# EAGLE design macu_board (EAGLE 6.5.0)
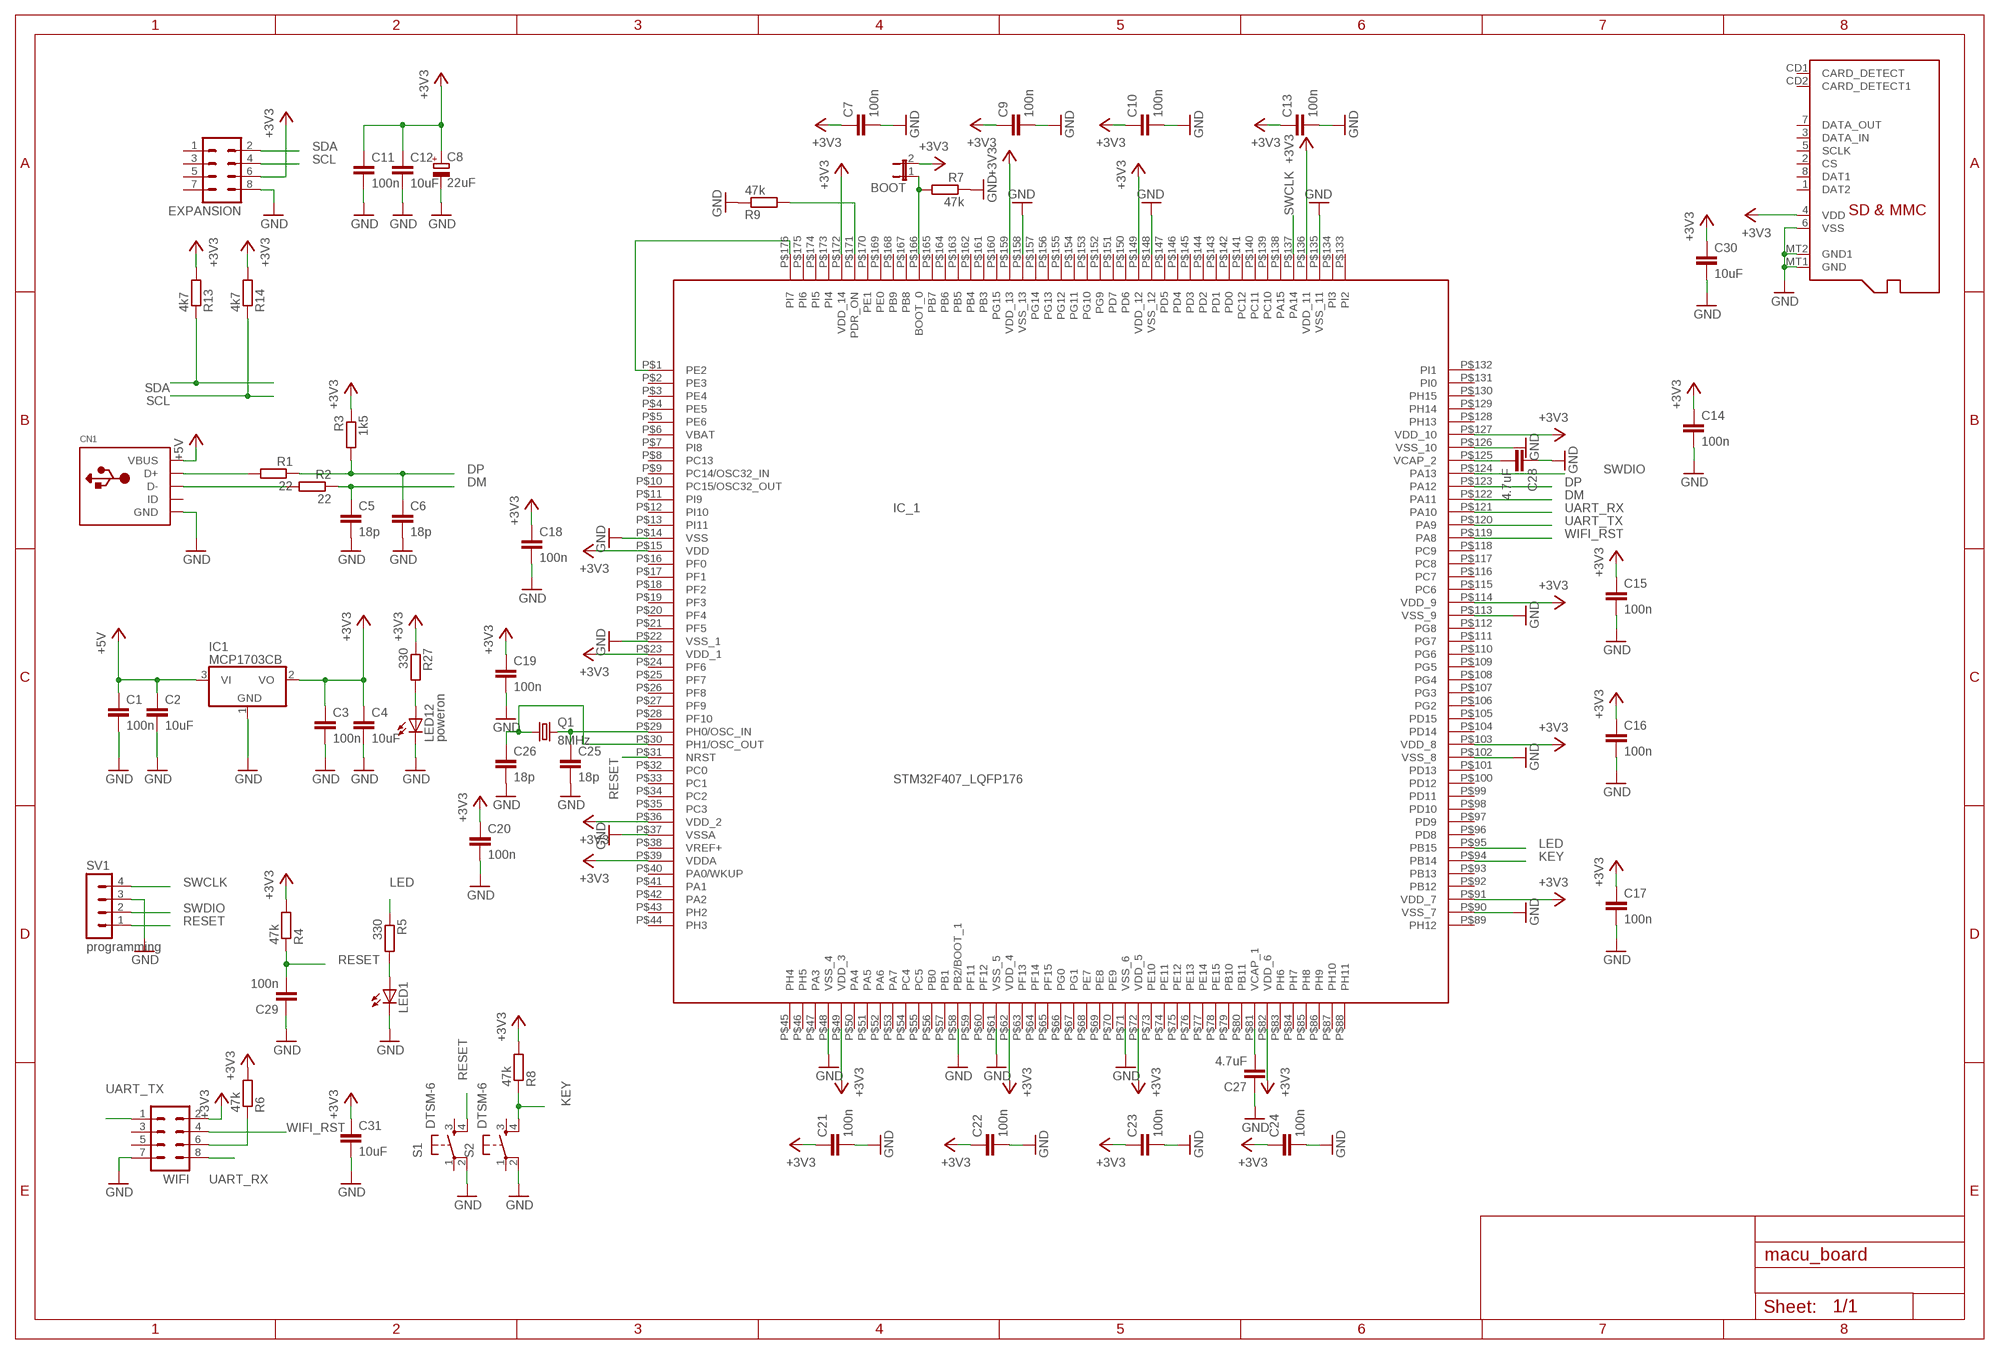
[diagram p0: schematic, sheet 1]

## Parts
BOOT  JP1E  [JP1]
C1  100n  C-EUC0805  [C0805]
C2  10uF  C-EUC0805  [C0805]
C3  100n  C-EUC0805  [C0805]
C4  10uF  C-EUC0805  [C0805]
C5  18p  C-EUC0805  [C0805]
C6  18p  C-EUC0805  [C0805]
C7  100n  C-EUC0805  [C0805]
C8  22uF  CPOL-EU153CLV-0505  [153CLV-0505]
C9  100n  C-EUC0805  [C0805]
C10  100n  C-EUC0805  [C0805]
C11  100n  C-EUC0805  [C0805]
C12  10uF  C-EUC0805  [C0805]
C13  100n  C-EUC0805  [C0805]
C14  100n  C-EUC0805  [C0805]
C15  100n  C-EUC0805  [C0805]
C16  100n  C-EUC0805  [C0805]
C17  100n  C-EUC0805  [C0805]
C18  100n  C-EUC0805  [C0805]
C19  100n  C-EUC0805  [C0805]
C20  100n  C-EUC0805  [C0805]
C21  100n  C-EUC0805  [C0805]
C22  100n  C-EUC0805  [C0805]
C23  100n  C-EUC0805  [C0805]
C24  100n  C-EUC0805  [C0805]
C25  18p  C-EUC0805  [C0805]
C26  18p  C-EUC0805  [C0805]
C27  4.7uF  C-EUC0805  [C0805]
C28  4.7uF  C-EUC0805  [C0805]
C29  100n  C-EUC0805  [C0805]
C30  10uF  C-EUC0805  [C0805]
C31  10uF  C-EUC0805  [C0805]
CN1  USBMINIB  [USB-MINIB]
EXPANSION  MA04-2  [MA04-2]
IC1  MCP1703CB  [SOT23]
IC_1  STM32F407_LQFP176  [STM32F407_LQFP176]
LED1  LEDCHIPLED_1206  [CHIPLED_1206]
LED12  poweron  LEDCHIPLED_1206  [CHIPLED_1206]
Q1  8MHz  CRYSTALCTS406  [CTS406]
R1  22  R-EU_M0805  [M0805]
R2  22  R-EU_M0805  [M0805]
R3  1k5  R-EU_M0805  [M0805]
R4  47k  R-EU_M0805  [M0805]
R5  330  R-EU_M0805  [M0805]
R6  47k  R-EU_M0805  [M0805]
R7  47k  R-EU_M0805  [M0805]
R8  47k  R-EU_M0805  [M0805]
R9  47k  R-EU_M0805  [M0805]
R13  4k7  R-EU_M0805  [M0805]
R14  4k7  R-EU_M0805  [M0805]
R27  330  R-EU_M0805  [M0805]
S1  DTSM-6  [DTSM-6]
S2  DTSM-6  [DTSM-6]
SV1  programming  MA04-1  [MA04-1]
U$1  MICROSD  [MICROSD]
WIFI  MA04-2  [MA04-2]

## Nets
+3V3: BOOT.2 C3.1 C4.1 C7.1 C8.+ C9.1 C10.1 C11.1 C12.1 C13.1 C14.1 C15.1 C16.1 C17.1 C18.1 C19.1 C20.1 C21.1 C22.1 C23.1 C24.1 C30.1 C31.1 EXPANSION.6 IC1.2(VO) IC_1.P$15(VDD) IC_1.P$23(VDD_1) IC_1.P$36(VDD_2) IC_1.P$39(VDDA) IC_1.P$49(VDD_3) IC_1.P$62(VDD_4) IC_1.P$72(VDD_5) IC_1.P$82(VDD_6) IC_1.P$91(VDD_7) IC_1.P$103(VDD_8) IC_1.P$114(VDD_9) IC_1.P$127(VDD_10) IC_1.P$136(VDD_11) IC_1.P$149(VDD_12) IC_1.P$159(VDD_13) IC_1.P$172(VDD_14) R3.1 R4.2 R6.2 R8.2 R13.2 R14.2 R27.1 U$1.4(VDD) WIFI.2
+5V: C1.1 C2.1 CN1.VBUS IC1.3(VI)
DM: C5.1 IC_1.P$122(PA11) R2.1
DP: C6.1 IC_1.P$123(PA12) R1.1 R3.2
GND: C1.2 C2.2 C3.2 C4.2 C5.2 C6.2 C7.2 C8.- C9.2 C10.2 C11.2 C12.2 C13.2 C14.2 C15.2 C16.2 C17.2 C18.2 C19.2 C20.2 C21.2 C22.2 C23.2 C24.2 C25.2 C26.2 C27.1 C28.1 C29.1 C30.2 C31.2 CN1.GND EXPANSION.8 IC1.1(GND) IC_1.P$14(VSS) IC_1.P$22(VSS_1) IC_1.P$37(VSSA) IC_1.P$48(VSS_4) IC_1.P$58(PB2/BOOT_1) IC_1.P$61(VSS_5) IC_1.P$71(VSS_6) IC_1.P$90(VSS_7) IC_1.P$102(VSS_8) IC_1.P$113(VSS_9) IC_1.P$126(VSS_10) IC_1.P$135(VSS_11) IC_1.P$148(VSS_12) IC_1.P$158(VSS_13) LED1.C LED12.C R7.1 R9.1 S1.2 S2.2 SV1.3 U$1.6(VSS) U$1.MT1(GND) U$1.MT2(GND1) WIFI.7
KEY: IC_1.P$94(PB14) R8.1 S2.4
LED: IC_1.P$95(PB15) R5.1
N$1: CN1.D+ R1.2
N$2: CN1.D- R2.2
N$3: C25.1 IC_1.P$29(PH0/OSC_IN) Q1.3
N$4: C26.1 IC_1.P$30(PH1/OSC_OUT) Q1.1
N$5: C27.2 IC_1.P$81(VCAP_1)
N$6: C28.2 IC_1.P$125(VCAP_2)
N$7: LED1.A R5.2
N$8: R6.1 WIFI.6
N$9: BOOT.1 IC_1.P$166(BOOT_0) R7.2
N$13: IC_1.P$171(PDR_ON) R9.2
N$14: IC_1.P$1(PE2) IC_1.P$176(PI7)
N$23: LED12.A R27.2
RESET: C29.2 IC_1.P$31(NRST) R4.1 S1.4 SV1.1
SCL: EXPANSION.4 R14.1
SDA: EXPANSION.2 R13.1
SWCLK: IC_1.P$137(PA14) SV1.4
SWDIO: IC_1.P$124(PA13) SV1.2
UART_RX: IC_1.P$121(PA10) WIFI.8
UART_TX: IC_1.P$120(PA9) WIFI.1
WIFI_RST: IC_1.P$119(PA8) WIFI.4
Unconnected: CN1.ID EXPANSION.1 EXPANSION.3 EXPANSION.5 EXPANSION.7 IC_1.P$2(PE3) IC_1.P$3(PE4) IC_1.P$4(PE5) IC_1.P$5(PE6) IC_1.P$7(PI8) IC_1.P$8(PC13) IC_1.P$9(PC14/OSC32_IN) IC_1.P$10(PC15/OSC32_OUT) IC_1.P$11(PI9) IC_1.P$12(PI10) IC_1.P$13(PI11) IC_1.P$16(PF0) IC_1.P$17(PF1) IC_1.P$18(PF2) IC_1.P$19(PF3) IC_1.P$20(PF4) IC_1.P$21(PF5) IC_1.P$24(PF6) IC_1.P$25(PF7) IC_1.P$26(PF8) IC_1.P$27(PF9) IC_1.P$28(PF10) IC_1.P$32(PC0) IC_1.P$33(PC1) IC_1.P$34(PC2) IC_1.P$35(PC3) IC_1.P$40(PA0/WKUP) IC_1.P$41(PA1) IC_1.P$42(PA2) IC_1.P$43(PH2) IC_1.P$44(PH3) IC_1.P$45(PH4) IC_1.P$46(PH5) IC_1.P$47(PA3) IC_1.P$50(PA4) IC_1.P$51(PA5) IC_1.P$52(PA6) IC_1.P$53(PA7) IC_1.P$54(PC4) IC_1.P$55(PC5) IC_1.P$56(PB0) IC_1.P$57(PB1) IC_1.P$59(PF11) IC_1.P$60(PF12) IC_1.P$63(PF13) IC_1.P$64(PF14) IC_1.P$65(PF15) IC_1.P$66(PG0) IC_1.P$67(PG1) IC_1.P$68(PE7) IC_1.P$69(PE8) IC_1.P$70(PE9) IC_1.P$73(PE10) IC_1.P$74(PE11) IC_1.P$75(PE12) IC_1.P$76(PE13) IC_1.P$77(PE14) IC_1.P$78(PE15) IC_1.P$79(PB10) IC_1.P$80(PB11) IC_1.P$83(PH6) IC_1.P$84(PH7) IC_1.P$85(PH8) IC_1.P$86(PH9) IC_1.P$87(PH10) IC_1.P$88(PH11) IC_1.P$89(PH12) IC_1.P$92(PB12) IC_1.P$93(PB13) IC_1.P$96(PD8) IC_1.P$97(PD9) IC_1.P$98(PD10) IC_1.P$99(PD11) IC_1.P$100(PD12) IC_1.P$101(PD13) IC_1.P$104(PD14) IC_1.P$105(PD15) IC_1.P$106(PG2) IC_1.P$107(PG3) IC_1.P$108(PG4) IC_1.P$109(PG5) IC_1.P$110(PG6) IC_1.P$111(PG7) IC_1.P$112(PG8) IC_1.P$115(PC6) IC_1.P$116(PC7) IC_1.P$117(PC8) IC_1.P$118(PC9) IC_1.P$128(PH13) IC_1.P$129(PH14) IC_1.P$130(PH15) IC_1.P$131(PI0) IC_1.P$132(PI1) IC_1.P$133(PI2) IC_1.P$134(PI3) IC_1.P$138(PA15) IC_1.P$139(PC10) IC_1.P$140(PC11) IC_1.P$141(PC12) IC_1.P$142(PD0) IC_1.P$143(PD1) IC_1.P$144(PD2) IC_1.P$145(PD3) IC_1.P$146(PD4) IC_1.P$147(PD5) IC_1.P$150(PD6) IC_1.P$151(PD7) IC_1.P$152(PG9) IC_1.P$153(PG10) IC_1.P$154(PG11) IC_1.P$155(PG12) IC_1.P$156(PG13) IC_1.P$157(PG14) IC_1.P$160(PG15) IC_1.P$161(PB3) IC_1.P$162(PB4) IC_1.P$163(PB5) IC_1.P$164(PB6) IC_1.P$165(PB7) IC_1.P$167(PB8) IC_1.P$168(PB9) IC_1.P$169(PE0) IC_1.P$170(PE1) IC_1.P$173(PI4) IC_1.P$174(PI5) IC_1.P$175(PI6) S1.1 S1.3 S2.1 S2.3 U$1.1(DAT2) U$1.2(CS) U$1.3(DATA_IN) U$1.5(SCLK) U$1.7(DATA_OUT) U$1.8(DAT1) U$1.CD1(CARD_DETECT) U$1.CD2(CARD_DETECT1) WIFI.3 WIFI.5

## Power pins joined to a net without a drawn wire
VBAT: IC_1.P$6(VBAT)
VREF+: IC_1.P$38(VREF+)

## Library data of the parts
BOOT = jumper:JP1E: JUMPER
C1-C7 C9-C31 = resistor:C-EU: CAPACITOR, European symbol
C8 = resistor:CPOL-EU: POLARIZED CAPACITOR, European symbol
CN1 = adafruit:USB: USB Connectors USBMINIB - Surface Mount Female Mini-B USB Connector 4UConnector: 06564 By microbuilder.eu Thru-hole RA Female Mini-B USB Connector 4UConnector: 18732 By ladyada.net
EXPANSION WIFI = con-lstb:MA04-2: PIN HEADER; OC_FARNELL: unknown; OC_NEWARK: unknown
IC1 = linear:MCP1703: 250 mA, 16V, Low Quiescent Current LDO Regulator Source: http://ww1.microchip.com/downloads/en/DeviceDoc/22049b.pdf
IC_1 = my_parts:STM32F407_LQFP176: STM32F407 in LQFP176 Package, 176 Pin Microcontroller (MCU) ARM Cortex M4 1024kB FLASH 168 Mhz 192kB SRAM
LED1 LED12 = led:LED: LED OSRAM: - CHIPLED LG R971, LG N971, LY N971, LG Q971, LY Q971, LO R971, LY R971 LH N974, LH R974 LS Q976, LO Q976, LY Q976 LO Q996 - Hyper CHIPLED LW Q18S LB Q993, LB Q99A, LB R99A - SideLED LS A670, LO A670, LY A670, LG A670, LP A670 LB A673, LV A673, LT A673, LW A673 LH A674 LY A675 LS A676, LA A676, LO A676, LY A676, LW A676 LS A679, LY A679, LG A679 - Hyper Micro SIDELED® LS Y876, LA Y876, LO Y876, LY Y876 LT Y87S - SmartLED LW L88C, LW L88S LB L89C, LB L89S, LG L890 LS L89K, LO L89K, LY L89K LS L896, LA L896, LO L896, LY L896 - TOPLED LS T670, LO T670, LY T670, LG T670, LP T670 LSG T670, LSP T670, LSY T670, LOP T670, LYG T670 LG T671, LOG T671, LSG T671 LB T673, LV T673, LT T673, LW T673 LH T674 LS T676, LA T676, LO T676, LY T676, LB T676, LH T676, LSB T676, LW T676 LB T67C, LV T67C, LT T67C, LS T67K, LO T67K, LY T67K, LW E67C LS E67B, LA E67B, LO E67B, LY E67B, LB E67C, LV E67C, LT E67C LW T67C LS T679, LY T679, LG T679 LS T770, LO T770, LY T770, LG T770, LP T770 LB T773, LV T773, LT T773, LW T773 LH T774 LS E675, LA E675, LY E675, LS T675 LS T776, LA T776, LO T776, LY T776, LB T776 LHGB T686 LT T68C, LB T68C - Hyper Mini TOPLED® LB M676 - Mini TOPLED Santana® LG M470 LS M47K, LO M47K, LY M47K Source: http://www.osram.convergy.de LUXEON: - LUMILED® LXK2-PW12-R00, LXK2-PW12-S00, LXK2-PW14-U00, LXK2-PW14-V00 LXK2-PM12-R00, LXK2-PM12-S00, LXK2-PM14-U00 LXK2-PE12-Q00, LXK2-PE12-R00, LXK2-PE12-S00, LXK2-PE14-T00, LXK2-PE14-U00 LXK2-PB12-K00, LXK2-PB12-L00, LXK2-PB12-M00, LXK2-PB14-N00, LXK2-PB14-P00, LXK2-PB14-Q00 LXK2-PR12-L00, LXK2-PR12-M00, LXK2-PR14-Q00, LXK2-PR14-R00 LXK2-PD12-Q00, LXK2-PD12-R00, LXK2-PD12-S00 LXK2-PH12-R00, LXK2-PH12-S00 LXK2-PL12-P00, LXK2-PL12-Q00, LXK2-PL12-R00 Source: www.luxeon.com KINGBRIGHT: KA-3528ASYC Source: www.kingbright.com
Q1 = crystal:CRYSTAL: CRYSTAL; OC_FARNELL: unknown; OC_NEWARK: unknown
R1-R9 R13 R14 R27 = resistor:R-EU_: RESISTOR, European symbol
S1 S2 = switch-tact:DTSM-6
SV1 = con-lstb:MA04-1: PIN HEADER; OC_FARNELL: unknown; OC_NEWARK: unknown
U$1 = adafruit:MICROSD: Micro-SD / Transflash card holder with SPI pinout For the 3M # 2908-05WB-MG and/or 4UCON #19656 push-push type

## Board
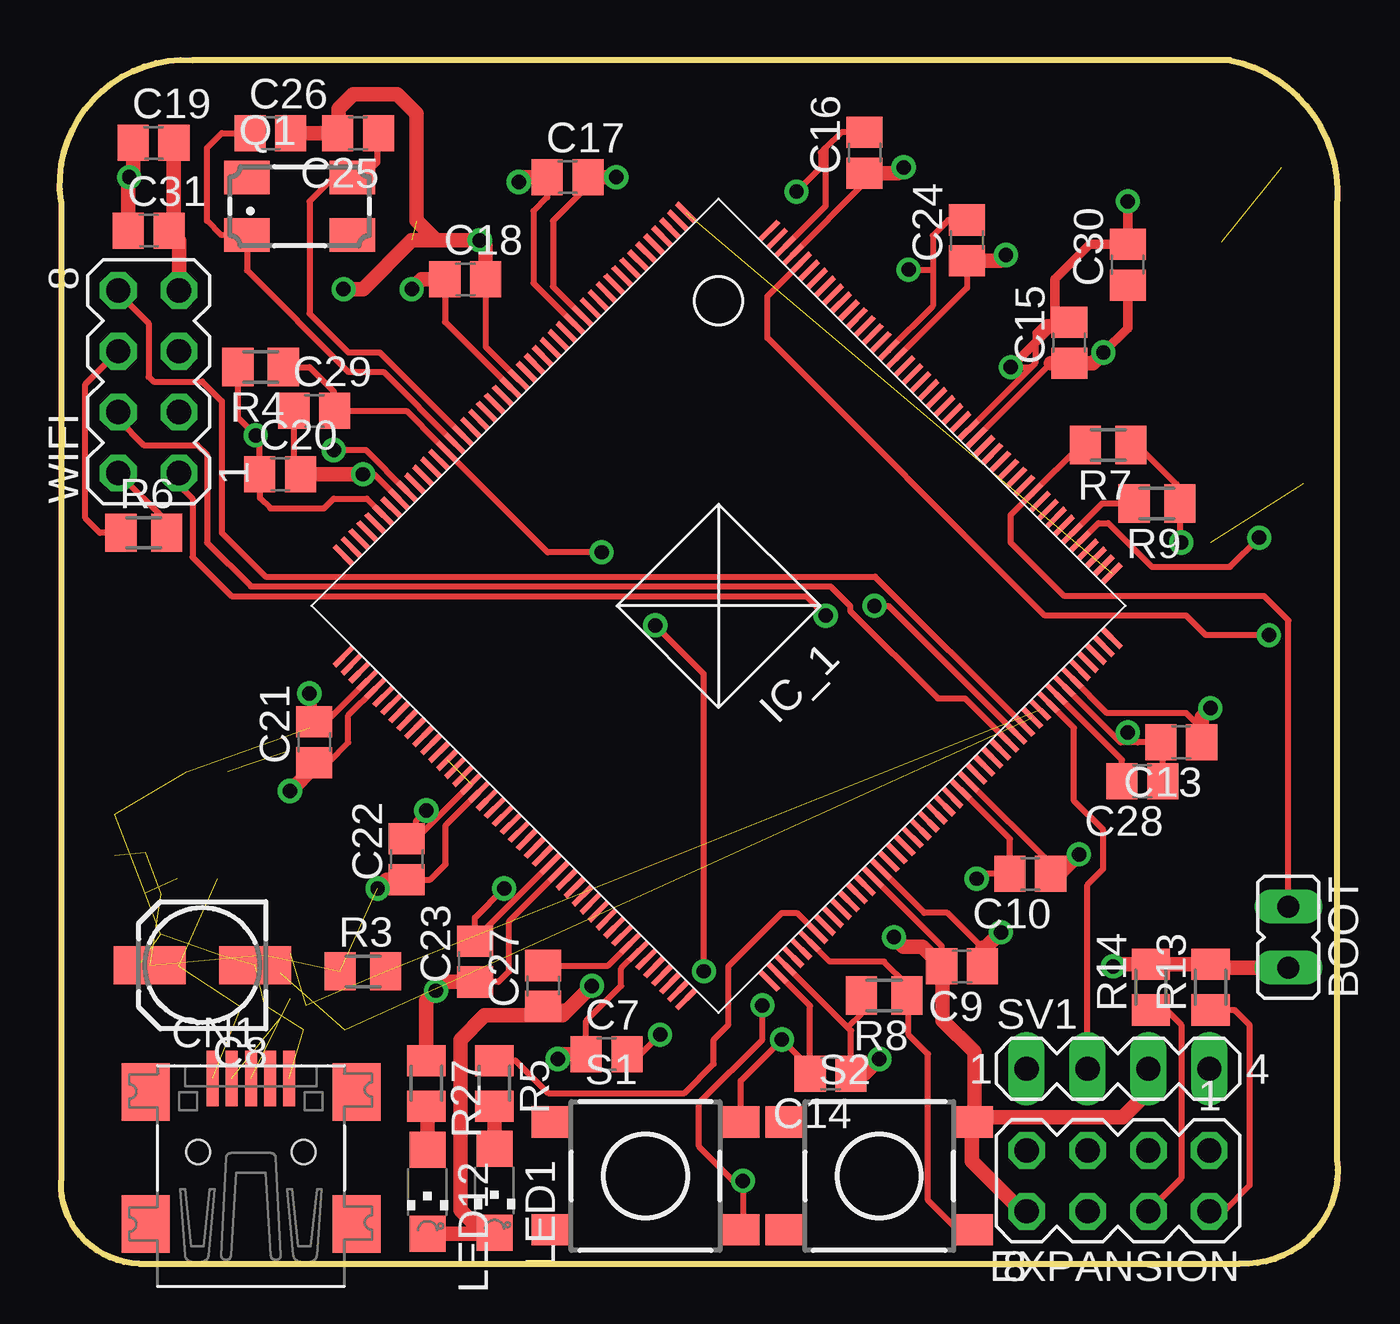
[diagram p1: board, top side]
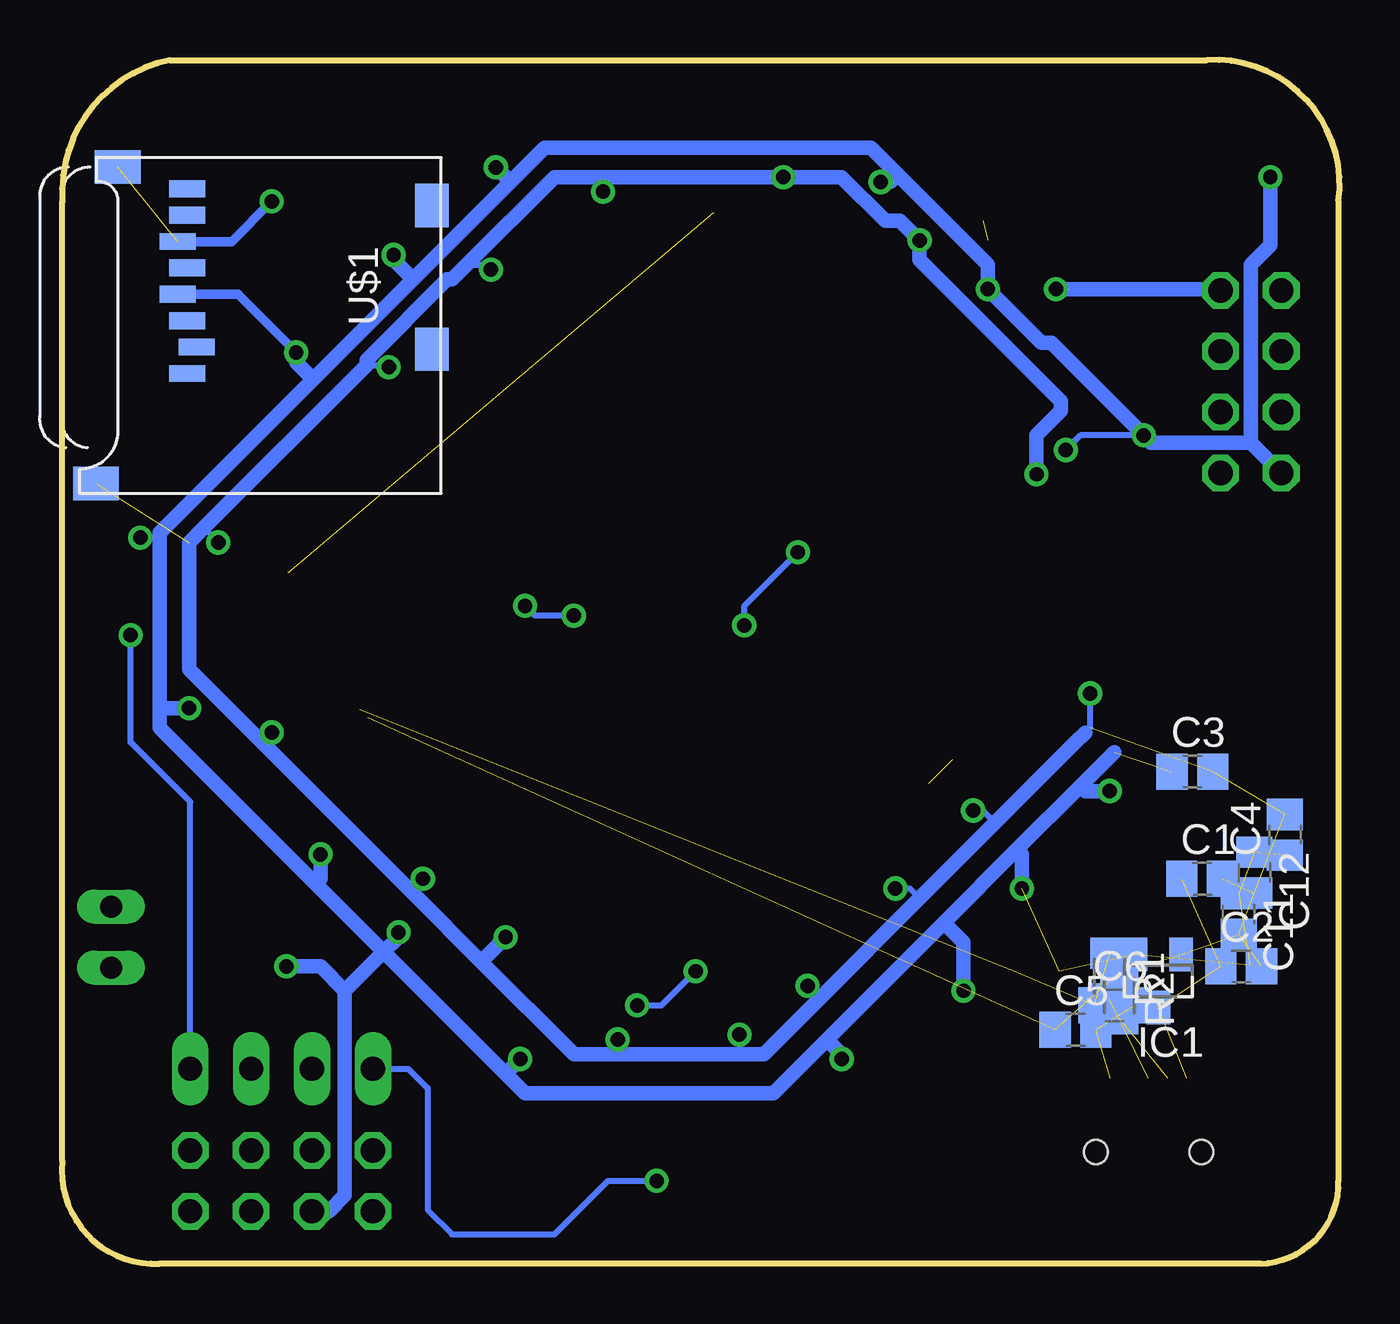
[diagram p2: board, bottom side, seen from below]

Size 53.3 x 50.2 mm. Coordinates in mm from the lower left corner, seen from the top.
Outline: 3.29,0 49.22,0 arc99 53.28,4.27 53.28,44.3 arc82 48.81,50.19 5.53,50.19 arc101 0.04,44.3 0.04,3.46 arc90 3.29,0
Copper layers (1*16): Top 0.035mm / dielectric 1.5mm / Bottom 0.035mm
Design rules "default *": minimum track width 7mil, minimum drill 24mil, track to track 7mil, track to pad 7mil, pad to pad 7mil, via to via 7mil, smd to smd 7mil, copper to edge 40mil, drill to drill 8mil, minimum pad ring 10mil, minimum via ring 8mil, stop-mask expansion 4mil, vias tented up to drill 0mil, thermal gap 10mil

### Footprints (pad centres in the part's own frame; a part is rotated, then mirrored left to right if it is on the bottom)
JP1 = drill 0.914 long: 1 0,-1.27; 2 0,1.27
C0805 = smd 1.3 x 1.5: 1 -0.85,0; 2 0.85,0
153CLV-0505 = smd 3 x 1.6: + 2.2,0; - -2.2,0
USB-MINIB = smd 0.5 x 2.308: D+ 0,4.064; D- -0.8,4.064; GND 1.6,4.064; ID 0.8,4.064; VBUS -1.6,4.064 | smd 2 x 2.4: GND1 -4.4,-2; GND2 -4.4,3.5; GND3 4.4,3.5; GND4 4.4,-2 | hole 1: -2.2,1; 2.2,1
MA04-2 = drill 1.016 octagon: 1 -3.81,-1.27; 2 -3.81,1.27; 3 -1.27,-1.27; 4 -1.27,1.27; 5 1.27,-1.27; 6 1.27,1.27; 7 3.81,-1.27; 8 3.81,1.27
SOT23 = smd 1 x 1.4: 1 -0.95,-1.1; 2 0.95,-1.1; 3 0,1.1
STM32F407_LQFP176 = smd 0.22 x 1.1: P$1 -10.64,-12.55; P$2 -10.17,-12.55; P$3 -9.7,-12.55; P$4 -9.23,-12.55; P$5 -8.76,-12.55; P$6 -8.29,-12.55; P$7 -7.82,-12.55; P$8 -7.35,-12.55; P$9 -6.88,-12.55; P$10 -6.41,-12.55; P$11 -5.94,-12.55; P$12 -5.47,-12.55; P$13 -5,-12.55; P$14 -4.53,-12.55; P$15 -4.06,-12.55; P$16 -3.59,-12.55; P$17 -3.12,-12.55; P$18 -2.65,-12.55; P$19 -2.18,-12.55; P$20 -1.71,-12.55; P$21 -1.24,-12.55; P$22 -0.77,-12.55; P$23 -0.3,-12.55; P$24 0.17,-12.55; P$25 0.64,-12.55; P$26 1.11,-12.55; P$27 1.58,-12.55; P$28 2.05,-12.55; P$29 2.52,-12.55; P$30 2.99,-12.55; P$31 3.46,-12.55; P$32 3.93,-12.55; P$33 4.4,-12.55; P$34 4.87,-12.55; P$35 5.34,-12.55; P$36 5.81,-12.55; P$37 6.28,-12.55; P$38 6.75,-12.55; P$39 7.22,-12.55; P$40 7.69,-12.55; P$41 8.16,-12.55; P$42 8.63,-12.55; P$43 9.1,-12.55; P$44 9.57,-12.55; P$89 9.56,12.55; P$90 9.09,12.55; P$91 8.62,12.55; P$92 8.15,12.55; P$93 7.68,12.55; P$94 7.21,12.55; P$95 6.74,12.55; P$96 6.27,12.55; P$97 5.8,12.55; P$98 5.33,12.55; P$99 4.86,12.55; P$100 4.39,12.55; P$101 3.92,12.55; P$102 3.45,12.55; P$103 2.98,12.55; P$104 2.51,12.55; P$105 2.04,12.55; P$106 1.57,12.55; P$107 1.1,12.55; P$108 0.63,12.55; P$109 0.16,12.55; P$110 -0.31,12.55; P$111 -0.78,12.55; P$112 -1.25,12.55; P$113 -1.72,12.55; P$114 -2.19,12.55; P$115 -2.66,12.55; P$116 -3.13,12.55; P$117 -3.6,12.55; P$118 -4.07,12.55; P$119 -4.54,12.55; P$120 -5.01,12.55; P$121 -5.48,12.55; P$122 -5.95,12.55; P$123 -6.42,12.55; P$124 -6.89,12.55; P$125 -7.36,12.55; P$126 -7.83,12.55; P$127 -8.3,12.55; P$128 -8.77,12.55; P$129 -9.24,12.55; P$130 -9.71,12.55; P$131 -10.18,12.55; P$132 -10.65,12.55 | smd 1.1 x 0.22: P$45 12.55,-9.57; P$46 12.55,-9.1; P$47 12.55,-8.63; P$48 12.55,-8.16; P$49 12.55,-7.69; P$50 12.55,-7.22; P$51 12.55,-6.75; P$52 12.55,-6.28; P$53 12.55,-5.81; P$54 12.55,-5.34; P$55 12.55,-4.87; P$56 12.55,-4.4; P$57 12.55,-3.93; P$58 12.55,-3.46; P$59 12.55,-2.99; P$60 12.55,-2.52; P$61 12.55,-2.05; P$62 12.55,-1.58; P$63 12.55,-1.11; P$64 12.55,-0.64; P$65 12.55,-0.17; P$66 12.55,0.3; P$67 12.55,0.77; P$68 12.55,1.24; P$69 12.55,1.71; P$70 12.55,2.18; P$71 12.55,2.65; P$72 12.55,3.12; P$73 12.55,3.59; P$74 12.55,4.06; P$75 12.55,4.53; P$76 12.55,5; P$77 12.55,5.47; P$78 12.55,5.94; P$79 12.55,6.41; P$80 12.55,6.88; P$81 12.55,7.35; P$82 12.55,7.82; P$83 12.55,8.29; P$84 12.55,8.76; P$85 12.55,9.23; P$86 12.55,9.7; P$87 12.55,10.17; P$88 12.55,10.64; P$133 -12.55,-9.57; P$134 -12.55,-9.1; P$135 -12.55,-8.63; P$136 -12.55,-8.16; P$137 -12.55,-7.69; P$138 -12.55,-7.22; P$139 -12.55,-6.75; P$140 -12.55,-6.28; P$141 -12.55,-5.81; P$142 -12.55,-5.34; P$143 -12.55,-4.87; P$144 -12.55,-4.4; P$145 -12.55,-3.93; P$146 -12.55,-3.46; P$147 -12.55,-2.99; P$148 -12.55,-2.52; P$149 -12.55,-2.05; P$150 -12.55,-1.58; P$151 -12.55,-1.11; P$152 -12.55,-0.64; P$153 -12.55,-0.17; P$154 -12.55,0.3; P$155 -12.55,0.77; P$156 -12.55,1.24; P$157 -12.55,1.71; P$158 -12.55,2.18; P$159 -12.55,2.65; P$160 -12.55,3.12; P$161 -12.55,3.59; P$162 -12.55,4.06; P$163 -12.55,4.53; P$164 -12.55,5; P$165 -12.55,5.47; P$166 -12.55,5.94; P$167 -12.55,6.41; P$168 -12.55,6.88; P$169 -12.55,7.35; P$170 -12.55,7.82; P$171 -12.55,8.29; P$172 -12.55,8.76; P$173 -12.55,9.23; P$174 -12.55,9.7; P$175 -12.55,10.17; P$176 -12.55,10.64
CHIPLED_1206 = smd 1.5 x 1.5: A 0,-1.75; C 0,1.75
CTS406 = smd 1.9 x 1.4: 1 -2.2,-1.2; 2 2.2,-1.2; 3 2.2,1.2; 4 -2.2,1.2
M0805 = smd 1.3 x 1.6: 1 -0.95,0; 2 0.95,0
DTSM-6 = smd 1.55 x 1.3: 1 -3.975,2.25; 2 3.975,2.25; 3 -3.975,-2.25; 4 3.975,-2.25
MA04-1 = drill 1.016 long: 1 -3.81,0; 2 -1.27,0; 3 1.27,0; 4 3.81,0
MICROSD = smd 0.7 x 1.5: 1 9,-10.64; 2 7.9,-10.24; 3 6.8,-10.64; 4 5.7,-11.04; 5 4.6,-10.64; 6 3.5,-11.04; 7 2.4,-10.64; 8 1.3,-10.64 | smd 1.8 x 1.4: CD1 2,-0.44; CD2 8,-0.44 | smd 1.4 x 1.9: MT1 0.4,-13.54; MT2 13.6,-14.44

### Placement (x,y rotation side)
BOOT  51.25,13.62 180 top
C1  5.73,16.06 0 bottom
C2  4.11,12.4 0 bottom
C3  6.14,20.53 0 bottom
C4  2.28,17.88 90 bottom
C5  11.02,9.76 0 bottom
C6  9.39,10.77 0 bottom
C7  22.8,8.74 0 top
C8  5.94,12.45 180 top
C9  37.64,12.4 180 top
C10  40.48,16.26 180 top
C11  4.21,14.58 270 bottom
C12  3.55,16.31 270 bottom
C13  46.78,21.74 180 top
C14  32.15,7.93 180 top
C15  42.11,38.41 90 top
C16  33.57,46.33 90 top
C17  21.18,45.32 0 top
C18  16.91,41.05 0 top
C19  3.9,46.74 0 top
C20  9.19,32.92 0 top
C21  10.61,21.74 90 top
C22  14.47,16.87 90 top
C23  17.32,12.6 90 top
C24  37.84,42.67 90 top
C25  12.44,47.14 180 top
C26  8.78,47.14 0 top
C27  20.16,11.58 90 top
C28  45.15,20.12 180 top
C29  10.61,35.56 0 top
C30  44.54,41.66 90 top
C31  3.7,43.08 0 top
CN1  7.97,3.66 0 top
EXPANSION  44.14,3.46 180 top
IC1  7.56,11.79 180 bottom
IC_1  27.48,27.43 225 top
LED1  18.13,3.05 180 top
LED12  15.33,3 180 top
Q1  10,44.1 0 top
R1  9.59,11.99 270 bottom
R2  9.19,11.18 270 bottom
R3  12.64,12.19 0 top
R4  8.38,37.39 180 top
R5  18.13,7.52 270 top
R6  3.5,30.48 0 top
R7  43.73,34.14 180 top
R8  34.38,11.18 180 top
R9  45.76,31.7 180 top
R13  48,11.53 90 top
R14  45.51,11.53 90 top
R27  15.28,7.52 270 top
S1  24.43,3.66 0 top
S2  34.18,3.66 0 top
SV1  44.14,8.13 0 top
U$1  37.43,46.13 270 bottom
WIFI  3.7,36.78 90 top

### Tracks (layer width: path | path; a pad name or v marks a point on that pad's centre or on a via)
+3V3  (via drill 0.6)  (7 unrouted)
  Top 0.254: C21.1 11.18,20.89 12.03,21.74 12.03,22.87 IC_1.P$49 | C22.1 15.45,16.02 16.1,16.66 16.1,18.29 IC_1.P$62 | C14.1 33,9.72 32.86,9.86 | 32.86,9.86 IC_1.P$91 | C9.1 38.49,13.17 37.03,14.63 36.06,14.63 IC_1.P$103 | C10.1 41.33,16.68 IC_1.P$114 | IC_1.P$72 18.74,14.28 18.74,12.19 18.29,11.75 C23.1 | C13.1 47.63,22.32 46.98,22.96 43.68,22.96 IC_1.P$127 | C15.1 41.35,37.56 IC_1.P$159 | C24.1 37.84,40.7 IC_1.P$149 | C16.1 33.57,45.07 IC_1.P$136 | C17.1 20.33,44.47 19.75,43.89 19.75,40.9 IC_1.P$15 | C18.1 16.06,39.28 IC_1.P$23 | IC_1.P$39 12.79,31.9 11.42,31.9 11.02,31.5 8.78,31.5 8.34,31.94 C20.1 8.34,34.38 v8.17,34.55 7.42,35.29 R4.2 | IC_1.P$36 12.76,33.94 v11.42,33.94 | C7.1 21.95,10.13 23.41,11.58 23.41,12.31 IC_1.P$82 | R6.2 4.45,30.95 WIFI.2 | IC_1.P$172 43.33,30.89 43.73,30.89 45.56,29.06 48.81,29.06 v50.03,30.28 | R8.2 33.43,10.43 32.86,9.86
  Top 0.406: C30.1 44.54,39.02 v43.53,38
  Top 0.61: C18.1 15.08,41.05 v14.67,40.64 | C17.1 19.35,45.32 v19.14,45.11 | C16.1 34.96,45.48 v35.2,45.72 | C24.1 39.22,41.82 v39.46,42.06 | 41.35,37.56 43.08,37.56 v43.53,38 | 47.63,22.32 47.63,22.8 v48,23.17 | C10.1 41.7,16.26 v42.51,17.07 | 38.49,13.17 38.61,13.17 v39.26,13.82 | C14.1 33.57,7.93 v34.18,8.54 | C22.1 13.62,16.02 v13.25,15.65 | C23.1 16.06,11.75 v15.69,11.38 15.28,10.98 R27.1 | C21.1 10.61,20.73 v9.59,19.71 | C7.1 20.97,8.74 v20.77,8.54 | C31.1 2.85,45.28 v2.89,45.32 3.05,45.48 C19.1 | v43.93,12.4 44.02,12.48 R14.2 R13.2 48.14,12.35 BOOT.2
  Bottom 0.254: v8.17,34.55 10.81,34.55 v11.42,33.94 | v50.03,30.28 49.22,30.28
  Bottom 0.406: U$1.4 45.96,40.43 v43.53,38
  Bottom 0.61: 18.43,45.42 14.67,41.66 v14.67,40.64 12.44,38.41 12.03,38.41 v8.17,34.55 7.87,34.24 3.7,34.24 | 18.43,45.42 19.55,46.54 33.17,46.54 34.59,45.11 | 34.59,45.11 38.65,41.05 | 38.65,41.05 42.82,36.88 | 42.82,36.88 49.22,30.48 49.22,30.28 49.22,23.17 | 49.22,23.17 49.22,22.35 42.72,15.85 | 42.72,15.85 39.87,13.01 | 39.87,13.01 34.79,7.93 | 34.79,7.93 33.98,7.11 23.61,7.11 21.38,9.35 | 21.38,9.35 16.5,14.23 | 16.5,14.23 13.45,17.27 | 13.45,17.27 10.81,19.92 | 10.81,19.92 9.39,21.34 | v19.14,45.11 18.74,45.11 18.43,45.42 | v35.2,45.72 34.59,45.11 | v39.46,42.06 39.46,41.86 38.65,41.05 | v43.53,38 43.53,37.59 42.82,36.88 | v48,23.17 49.22,23.17 | v42.51,17.07 42.51,16.06 42.72,15.85 | v39.26,13.82 39.26,13.62 39.87,13.01 | v34.18,8.54 34.79,7.93 | v20.77,8.54 20.77,8.74 21.38,9.35 | v13.25,15.65 13.25,17.07 13.45,17.27 | v15.69,11.38 15.69,13.41 16.5,14.23 | v9.59,19.71 10.61,19.71 10.81,19.92 | v2.89,45.32 2.89,42.47 3.7,41.66 3.7,34.24 | 3.7,34.24 WIFI.2 | EXPANSION.6 42.16,2.19 41.5,2.85 41.5,11.38 | 41.5,11.38 39.87,13.01 | v43.93,12.4 42.51,12.4 41.5,11.38
+5V  (3 unrouted)
DM  (2 unrouted)
DP  (3 unrouted)
GND  (via drill 0.6)  (15 unrouted)
  Top 0.254: IC_1.P$48 11.1,22.59 C21.2 10.61,23.57 v10.41,23.78 | C22.2 14.86,17.72 | 14.86,17.72 IC_1.P$61 | IC_1.P$90 31.3,10.76 C14.2 31.3,8.17 v30.12,9.35 28.4,7.64 S1.2 | IC_1.P$102 36.79,13.25 C9.2 36.42,12.03 | IC_1.P$113 39.63,17.71 C10.2 38.45,16.26 v38.25,16.06 | IC_1.P$71 17.32,13.53 C23.2 17.32,14.43 v18.53,15.65 | C13.2 44.24,21.74 IC_1.P$126 | C28.1 46,21.67 C13.2 | C15.2 41.13,39.26 40.68,38.81 40.68,37.56 40.5,37.37 | 40.5,37.37 IC_1.P$158 | C24.2 37.06,43.52 36.42,42.88 36.42,41.46 | 36.42,41.46 36.42,39.94 IC_1.P$148 | C16.2 32.59,47.18 31.95,46.54 | 31.95,46.54 31.95,44.11 IC_1.P$135 | C17.2 22.03,44.95 20.57,43.49 20.57,40.75 IC_1.P$14 | C18.2 17.76,38.24 IC_1.P$22 | v12.64,32.92 13.11,32.92 IC_1.P$37 | C29.1 9.76,33.2 C20.2 | 31.95,46.54 31.74,46.33 31.74,45.72 v30.73,44.71 | v35.4,41.46 36.42,41.46 | v39.67,37.39 40.48,37.39 40.5,37.37 | C13.2 44.95,21.74 v44.54,22.15 | C7.2 24.22,8.74 v25.04,9.55 | C27.1 21.34,10.73 v22.19,11.58 | 14.86,17.72 14.86,18.48 v15.28,18.9 | R7.1 44.95,34.14 46.58,32.51 46.58,31.84 R9.1 46.71,30.14 v46.78,30.08
  Top 0.406: v39.67,37.39 41.5,39.22 41.5,41.05 42.96,42.51 C30.2 v44.54,44.3
  Top 0.61: C18.2 17.76,42.43 v17.52,42.67 14.67,42.67 12.64,40.64 v11.83,40.64 | v12.64,32.92 C20.2 | C26.2 C25.2 11.63,47.18 11.63,48.16 12.24,48.77 14.06,48.77 14.88,47.96 14.88,43.49 15.69,42.67 | v23.21,45.32 C17.2 | WIFI.7 4.97,42.66 C31.2 4.75,43.28 C19.2 | LED12.C 18.08,1.25 LED1.C 17.64,1.3 16.71,2.24 16.71,9.35 17.72,10.37 20.97,10.37 v22.19,11.58 | EXPANSION.8 40.12,2.19 38.04,4.27 38.04,5.8 S2.2 | S2.2 38.16,8.83 36.82,10.16 36.82,12.36 C9.2 35.97,13.21 35.2,13.21 v34.79,13.62 | SV1.3 45.41,7.17 44.34,6.1 38.34,6.1 S2.2
  Bottom 0.254: v30.73,44.71 30.73,45.32 | 36.42,41.66 35.6,41.66 v35.4,41.46 | 40.6,37.48 39.75,37.48 v39.67,37.39 | v44.54,22.15 45.36,22.15 45.56,22.35 | v38.25,16.06 38.25,15.85 38.65,15.45 | v30.12,9.35 30.12,8.74 | v25.04,9.55 25.04,8.74 | v22.19,11.58 22.19,11.38 21.79,10.98 | v18.53,15.65 17.93,15.65 17.52,15.24 | v15.28,18.9 14.88,18.9 14.37,18.39 | v10.41,23.78 10.41,22.35 11.02,21.74 | v46.78,30.08 47.39,30.69
  Bottom 0.406: U$1.6 46.22,42.63 v44.54,44.3
  Bottom 0.61: v12.64,32.92 12.64,34.55 11.63,35.56 11.63,35.97 17.52,41.86 v17.52,42.67 18.33,43.49 18.94,43.49 20.77,45.32 v23.21,45.32 30.73,45.32 32.76,45.32 36.42,41.66 | 36.42,41.66 | 40.6,37.48 | 40.6,37.48 47.39,30.69 48,30.08 48,24.79 45.56,22.35 38.65,15.45 35.81,12.6 | 35.81,12.6 31.95,8.74 30.12,8.74 25.04,8.74 24.02,8.74 21.79,10.98 17.52,15.24 14.37,18.39 11.02,21.74 10.61,22.15 | 40.6,37.48 40.6,37.68 37.23,41.05 37.03,41.05 36.42,41.66 | v11.83,40.64 5.02,40.64 WIFI.7 | v34.79,13.62 35.81,12.6
KEY
  Top 0.254: S2.4 37.45,1.41 36.21,2.64 36.21,8.74 35.4,9.55 35.4,11.11 R8.1 35.33,11.65 34.38,12.6 32.11,12.6 IC_1.P$94
LED
  Top 0.254: R5.1 19.01,8.47 20.36,7.11 26.05,7.11 27.27,8.33 27.27,9.35 27.88,9.96 27.88,12.4 30.12,14.63 30.75,14.63 IC_1.P$95
N$1  (1 unrouted)
N$2  (1 unrouted)
N$3
  Top 0.254: IC_1.P$29 13.35,38 12.03,38 10.41,39.63 10.41,44.3 11.4,45.3 Q1.3 12.62,45.3 13.25,45.93 13.25,47.11 C25.1
N$4
  Top 0.254: IC_1.P$30 13.49,37.19 12.03,37.19 7.8,41.42 Q1.1 6.73,42.9 6.14,43.49 6.14,46.54 6.75,47.14 C26.1
N$5
  Top 0.254: C27.2 22.87,12.43 IC_1.P$81
N$6
  Top 0.254: C28.2 44.3,21.01 IC_1.P$125
N$7
  Top 0.61: R5.2 LED1.A
N$8
  Top 0.254: R6.1 1.67,30.48 1.06,31.09 1.06,36.68 WIFI.6
N$9
  Top 0.254: R7.2 42.58,34.14 IC_1.P$166 39.67,31.23 39.67,30.08 41.9,27.84 50.23,27.84 51.25,26.82 BOOT.1
N$13
  Top 0.254: R9.2 43.47,31.7 IC_1.P$171
N$14  (1 unrouted)
N$23
  Top 0.61: LED12.A 15.33,6.52 R27.2
RESET  (via drill 0.6)
  Top 0.254: R4.1 10.41,37.39 11.42,36.38 11.42,35.19 C29.2 14.45,35.56 15.78,34.23 IC_1.P$31 20.35,29.67 v22.6,29.67 | S1.4 28.49,1.5 v28.49,3.46 28.09,3.46 26.66,4.88 26.66,6.71 29.3,9.35 v29.3,10.77 | v26.87,12.19 26.87,24.59 v24.83,26.62
  Bottom 0.254: SV1.1 38.85,8.13 38.04,7.32 38.04,2.24 37.03,1.22 32.76,1.22 30.52,3.46 v28.49,3.46 | v29.3,10.77 28.29,10.77 v26.87,12.19 | v24.83,26.62 24.83,27.43 v22.6,29.67
SCL
  Top 0.254: R14.1 46.15,10.58 46.78,9.96 46.78,3.56 EXPANSION.4
SDA
  Top 0.254: R13.1 49,10.58 49.62,9.96 49.62,3.25 48.61,2.24 48,2.24 EXPANSION.2
SWCLK  (via drill 0.6)
  Top 0.254: v50.44,26.22 47.8,26.22 46.98,27.03 41.09,27.03 29.51,38.61 29.51,40.34 IC_1.P$137
  Bottom 0.254: SV1.4 47.95,19.26 50.44,21.74 v50.44,26.22
SWDIO
  Top 0.254: SV1.2 42.87,15.8 43.53,16.46 43.53,18.09 42.31,19.31 42.31,22.34 IC_1.P$124
UART_RX
  Top 0.254: WIFI.8 2.43,40.49 3.7,39.22 3.7,36.98 3.9,36.78 5.94,36.78 6.75,35.97 6.75,30.48 8.58,28.65 34.01,28.65 IC_1.P$121
UART_TX  (via drill 0.6)
  Top 0.254: WIFI.1 4.97,32.46 5.53,31.9 5.53,29.47 7.16,27.84 31.13,27.84 v31.95,27.03 | v33.98,27.43 34.56,27.43 IC_1.P$120
  Bottom 0.254: v31.95,27.03 33.57,27.03 v33.98,27.43
WIFI_RST
  Top 0.254: WIFI.4 2.43,35.21 3.5,34.14 5.73,34.14 6.14,33.73 6.14,30.08 7.97,28.25 32.15,28.25 32.96,27.43 32.96,27.23 36.62,23.57 37.76,23.57 IC_1.P$119